# Altium schematic sheet CNEPuckRevG_Drivers_1.SchDoc: Cable Node Expansion Puck
size C; Author: JDV; CompanyName: OPIsystems Inc; DrawnBy: JDV; Engineer: JDV; Organization: OPIsystems Inc; DocumentNumber: CNE; Revision: REV G; SheetNumber: 2; SheetTotal: 3; ProjectName: Swage
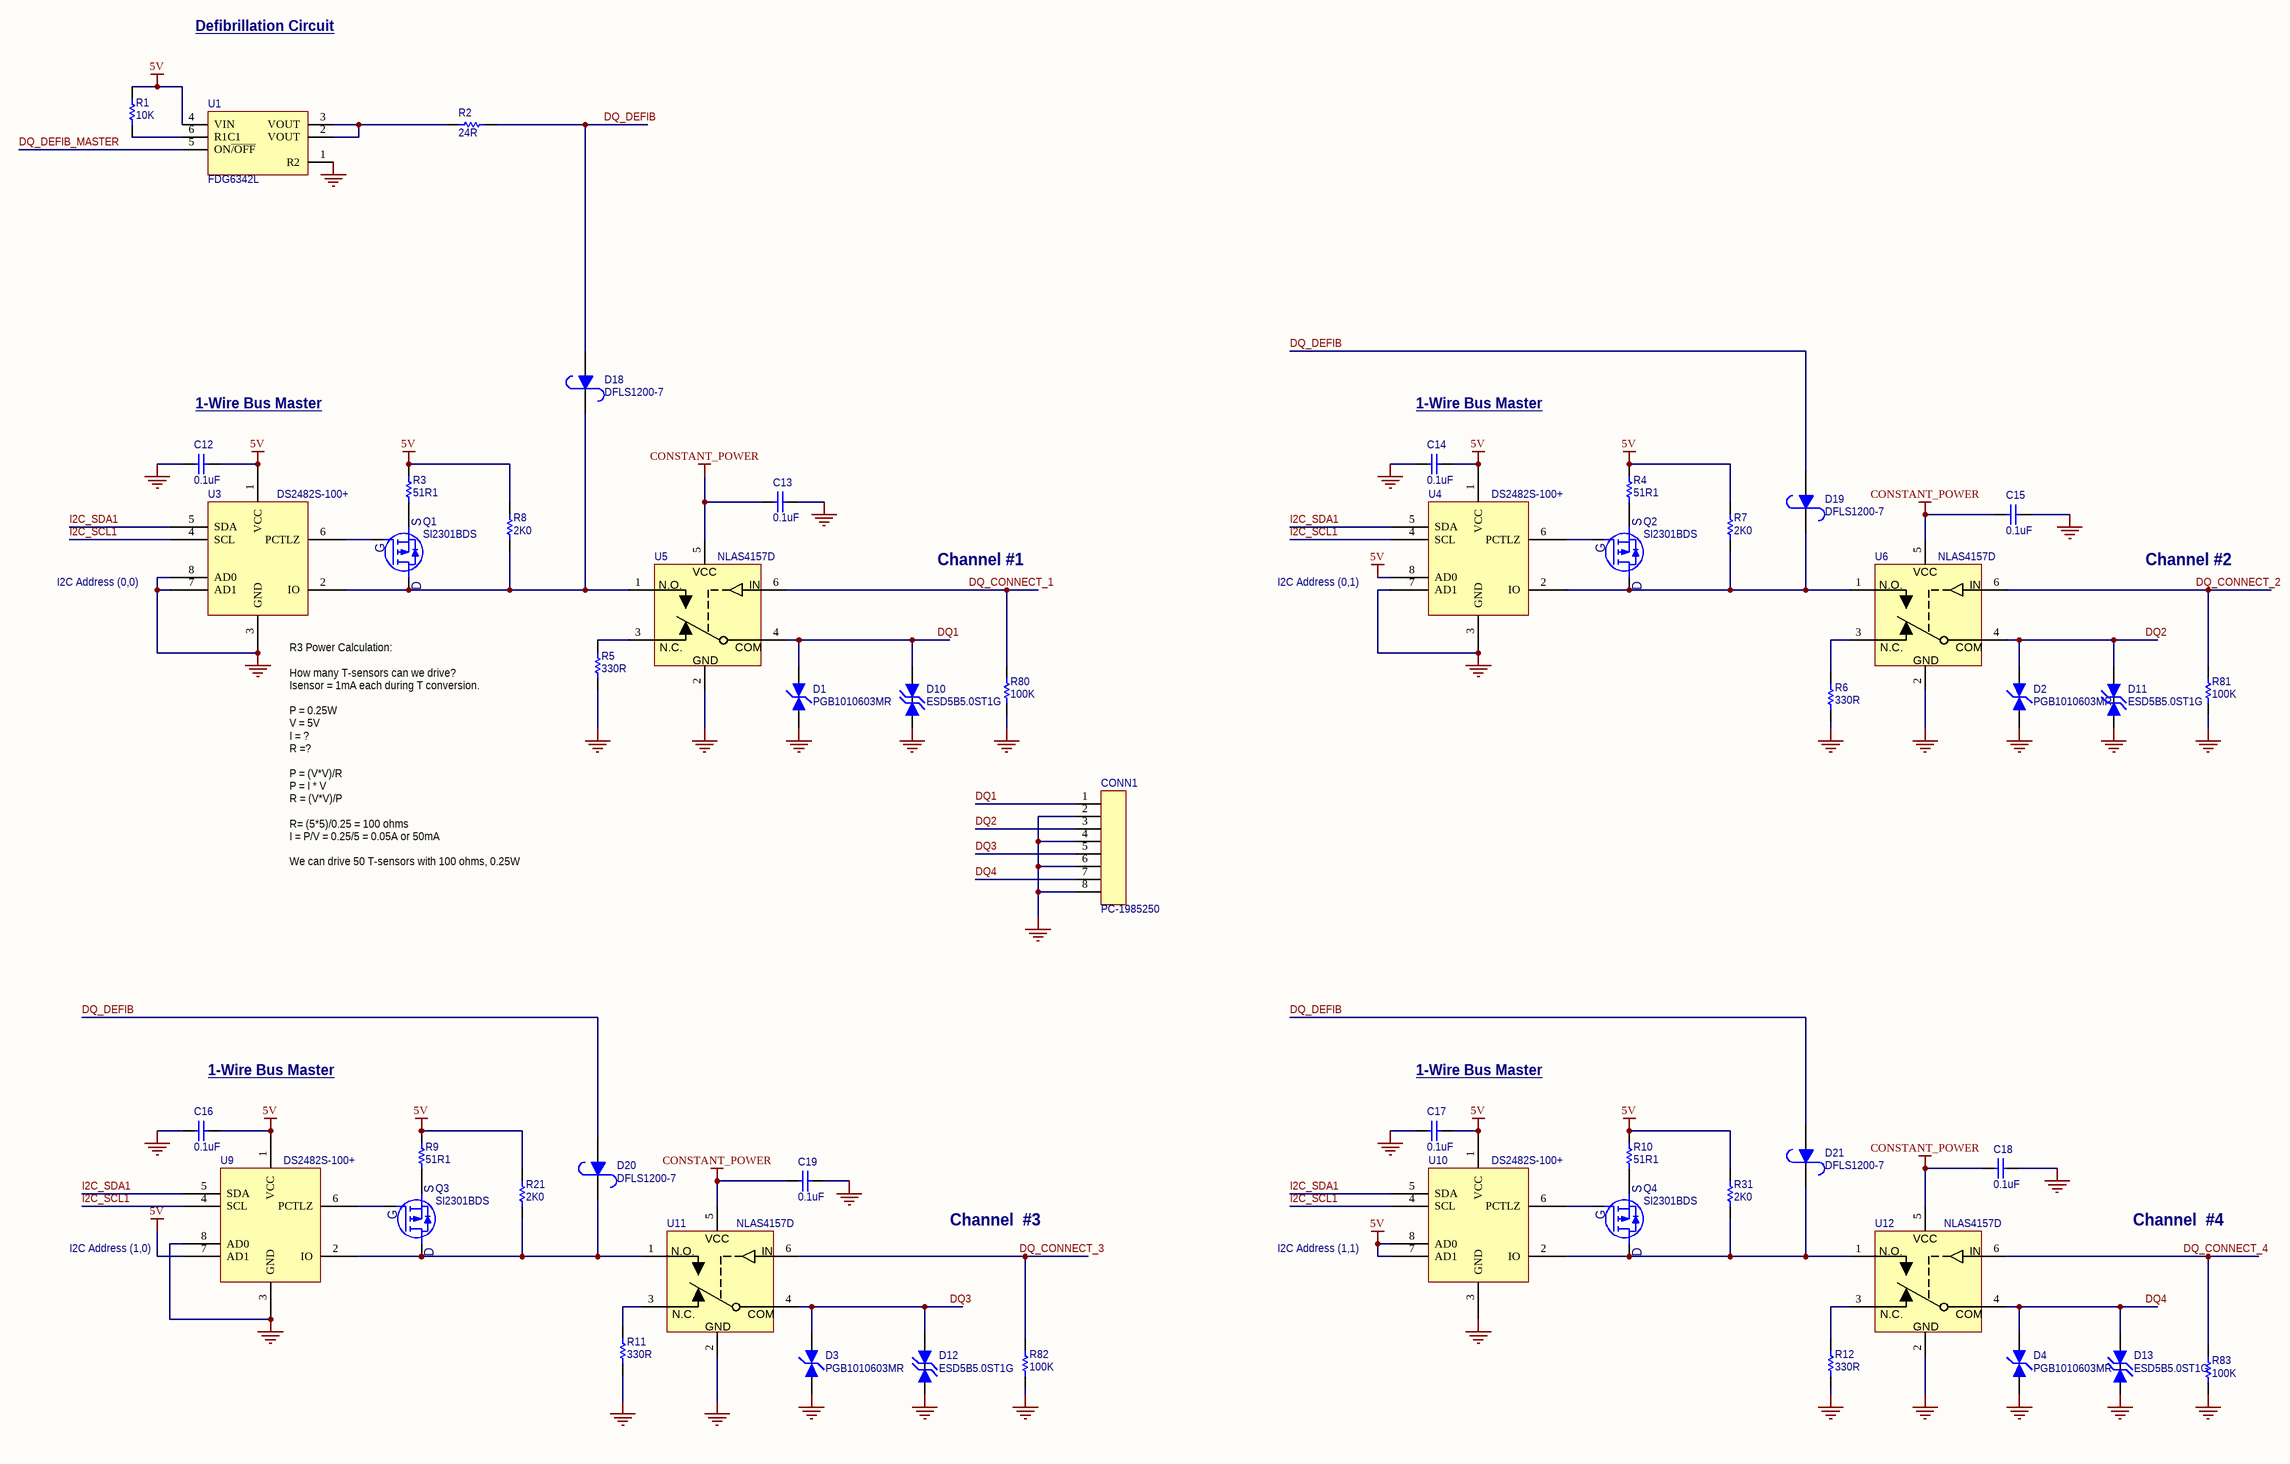
[diagram p0: CNEPuckRevG_Drivers_1.SchDoc]

## Parts
C12  0.1uF  [RC0603]
C13  0.1uF  [RC0603]
C14  0.1uF  [RC0603]
C15  0.1uF  [RC0603]
C16  0.1uF  [RC0603]
C17  0.1uF  [RC0603]
C18  0.1uF  [RC0603]
C19  0.1uF  [RC0603]
CONN1  PC-1985250  [PTSA1.5/8-3.5-Z]
D1  PGB1010603MR  [RC0603]
D2  PGB1010603MR  [RC0603]
D3  PGB1010603MR  [RC0603]
D4  PGB1010603MR  [RC0603]
D10  ESD5B5.0ST1G  [SOD-523]
D11  ESD5B5.0ST1G  [SOD-523]
D12  ESD5B5.0ST1G  [SOD-523]
D13  ESD5B5.0ST1G  [SOD-523]
D18  DFLS1200-7  [POWERDI-123]
D19  DFLS1200-7  [POWERDI-123]
D20  DFLS1200-7  [POWERDI-123]
D21  DFLS1200-7  [POWERDI-123]
Q1  SI2301BDS  [SOT23(DGS)]
Q2  SI2301BDS  [SOT23(DGS)]
Q3  SI2301BDS  [SOT23(DGS)]
Q4  SI2301BDS  [SOT23(DGS)]
R1  10K  [RC0603]
R2  24R  [RES2512]
R3  51R1  [RC0603]
R4  51R1  [RC0603]
R5  330R  [RC0805]
R6  330R  [RC0805]
R7  2K0  [RC0603]
R8  2K0  [RC0603]
R9  51R1  [RC0603]
R10  51R1  [RC0603]
R11  330R  [RC0805]
R12  330R  [RC0805]
R21  2K0  [RC0603]
R31  2K0  [RC0603]
R80  100K  [RC0603]
R81  100K  [RC0603]
R82  100K  [RC0603]
R83  100K  [RC0603]
U1  FDG6342L  [TS5A3160]
U3  DS2482S-100+  [SOIC127P580X153-8N]
U4  DS2482S-100+  [SOIC127P580X153-8N]
U5  NLAS4157D  [TS5A3160]
U6  NLAS4157D  [TS5A3160]
U9  DS2482S-100+  [SOIC127P580X153-8N]
U10  DS2482S-100+  [SOIC127P580X153-8N]
U11  NLAS4157D  [TS5A3160]
U12  NLAS4157D  [TS5A3160]

## Nets
5V: C12.2 C14.2 C16.2 C17.2 R1.1 R3.1 R4.1 R7.1 R8.1 R9.1 R10.1 R21.1 R31.1 U1.4(VIN) U3.1(VCC) U4.1(VCC) U4.8(AD0) U9.1(VCC) U9.7(AD1) U10.1(VCC) U10.7(AD1) U10.8(AD0)
CONSTANT_POWER: C13.1 C15.1 C18.1 C19.1 U5.5 U6.5 U11.5 U12.5
GND: C12.1 C13.2 C14.1 C15.2 C16.1 C17.1 C18.2 C19.2 CONN1.2 CONN1.4 CONN1.6 CONN1.8 D1.1 D2.1 D3.1 D4.1 D10.1 D11.1 D12.1 D13.1 R5.2 R6.2 R11.2 R12.2 R80.2 R81.2 R82.2 R83.2 U1.1(R2) U3.3(GND) U3.7(AD1) U3.8(AD0) U4.3(GND) U4.7(AD1) U5.2(GND) U6.2(GND) U9.3(GND) U9.8(AD0) U10.3(GND) U11.2(GND) U12.2(GND)
DQ1: CONN1.1 D1.2 D10.2 U5.4
DQ2: CONN1.3 D2.2 D11.2 U6.4
DQ3: CONN1.5 D3.2 D12.2 U11.4
DQ4: CONN1.7 D4.2 D13.2 U12.4
DQ_CONNECT_1: R80.1 U5.6
DQ_CONNECT_2: R81.1 U6.6
DQ_CONNECT_3: R82.1 U11.6
DQ_CONNECT_4: R83.1 U12.6
DQ_DEFIB: D18.1(A) D19.1(A) D20.1(A) D21.1(A) R2.2
DQ_DEFIB_MASTER: U1.5(ON~{/OFF})
I2C_SCL1: U3.4(SCL) U4.4(SCL) U9.4(SCL) U10.4(SCL)
I2C_SDA1: U3.5(SDA) U4.5(SDA) U9.5(SDA) U10.5(SDA)
NetD18_2: D18.2(K) Q1.D R8.2 U3.2(IO) U5.1(NO)
NetD19_2: D19.2(K) Q2.D R7.2 U4.2(IO) U6.1(NO)
NetD20_2: D20.2(K) Q3.D R21.2 U9.2(IO) U11.1(NO)
NetD21_2: D21.2(K) Q4.D R31.2 U10.2(IO) U12.1(NO)
NetQ1_G: Q1.G U3.6(PCTLZ)
NetQ1_S: Q1.S R3.2
NetQ2_G: Q2.G U4.6(PCTLZ)
NetQ2_S: Q2.S R4.2
NetQ3_G: Q3.G U9.6(PCTLZ)
NetQ3_S: Q3.S R9.2
NetQ4_G: Q4.G U10.6(PCTLZ)
NetQ4_S: Q4.S R10.2
NetR1_2: R1.2 U1.6(R1C1)
NetR2_1: R2.1 U1.2(VOUT) U1.3(VOUT)
NetR5_1: R5.1 U5.3(NC)
NetR6_1: R6.1 U6.3(NC)
NetR11_1: R11.1 U11.3(NC)
NetR12_1: R12.1 U12.3(NC)

## Notes on the sheet
- Defibrillation Circuit
- 1-Wire Bus Master
- I2C Address (0,0)
- Channel #1
- I2C Address (0,1)
- Channel #2
- (near U3) R3 Power Calculation:
  How many T-sensors can we drive?
  Isensor = 1mA each during T conversion.
  P = 0.25W
  V = 5V
  I = ?
  R =?
  P = (V*V)/R
  P = I * V
  R = (V*V)/P
  R= (5*5)/0.25 = 100 ohms
  I = P/V = 0.25/5 = 0.05A or 50mA
  We can drive 50 T-sensors with 100 ohms, 0.25W resistor.
- Channel  #3
- Channel  #4
- I2C Address (1,0)
- I2C Address (1,1)
- Title:
- OPIsystems Inc.
- Size:
- Date:
- File:
- C
- Number:
- Time:
- Revision:
- Sheet
- of
- Calgary, AB, Canada
- T2E 6M8
- 403-219-3177
- www.opisystems.com
- 1216 - 36th Avenue NE
- (in symbol NLAS4157DFT2G) VCC; N.O.; IN; N.C.; COM

## Library data of the parts
C12-C19 = 0603YC104KAT2A: CAP CERM .1UF 10% 16V X7R 0603; Manufacturer: AVX Corporation; Category 1: Capacitors; Capacitance: 0.1µF; OPI_VID: 100039; Supplier 1: Digi-Key; Supplier Part Number 1: 478-1239-2-ND; RoHS 1: RoHS Compliant; Description 1: CAP CERM .1UF 10% 16V X7R 0603; Stock 1: 5240000; Pricing 1: 4000=0.003, 12000=0.002, 24000=0.002 (USD); Voltage - Rated: 16V; Tolerance: ±10%; Temperature Coefficient: X7R; Mounting Type: Surface Mount, MLCC; Operating Temperature: -55°C ~ 125°C; Features: -; Applications: General Purpose; Ratings: -; Package / Case: 0603 (1608 Metric); Size / Dimension: 0.063" L x 0.031" W (1.60mm x 0.80mm); Thickness: 0.90mm Max; Lead Spacing: -; Packaging: Tape & Reel (TR); Lead Style: -; ComponentLink1URL: http://www.avx.com/docs/Catalogs/cx7r.pdf; ComponentLink1Description: http://www.avx.com/docs/Catalogs/cx7r.pdf; Manufacturer Part Number: 0603YC104KAT2A
CONN1 = 1985250: TERM BLOCK PCB 8POS 3.5MM GREEN; Manufacturer: Phoenix Contact; Number of Levels: 1; Positions Per Level: 8; Pitch: 0.138" (3.50mm); Mating Orientation: 45° (135°) Angle with Board; Current: 2A; Voltage: 300V; Wire Gauge: 16-24 AWG; Wire Termination: Screwless - Spring Cage, Tension Clamp; OPI_VID: 101356; Supplier 1: Digi-Key; Manufacturer Part Number: 1985250; RoHS: RoHS Compliant; Category: Connectors, Interconnects; Stock 1: 3617; Pricing 1: 1=0.9, 10=0.861, 50=0.8374, 100=0.7828, 250=0.72016, 500=0.66536 (CAD); Mounting Type: Through Hole; Features: -; Color: Green; Packaging: Bulk; Operating Temperature: -; Housing Material: Polyamide (PA), Nylon; Contact Material - Plating: -; Clamp Material - Plating: -; Screw Material - Plating: -; Torque - Screw: -; Screw Thread: -; ComponentLink1URL: http://www.phoenixcontact.com/online/portal/us/pxc/product_detail_page/!ut/p/b1/04_SjzQ0tTQ2MTMzM7TQj9CPykssy0xPLMnMz0vMAfGjzOJDnEJcXQOMzAz9A02dDDxdTJ1dfUyCDD38jIAKIvEocDQkTr8BDuBoQEh_uH4UXiUgF4AV4LHCzyM_N1U_NyrHzdJT1xEAasn7vg!!/dl4/d5/L0lDU0lKSmdrS0NsRUp; ComponentLink1Description: http://www.phoenixcontact.com/online/portal/us/pxc/product_detail_page/!ut/p/b1/04_SjzQ0tTQ2MTMzM7TQj9CPykssy0xPLMnMz0vMAfGjzOJDnEJcXQOMzAz9A02dDDxdTJ1dfUyCDD38jIAKIvEocDQkTr8BDuBoQEh_uH4UXiUgF4AV4LHCzyM_N1U_NyrHzdJT1xEAasn7vg!!/dl4/d5/L0lDU0lKSmdrS0NsRUp; Supplier Part Number 1: 277-1628-ND
D1-D4 = PGB1010603MR: SUPPRESSOR ESD 24VDC 0603 SMD; Manufacturer: Littelfuse Inc; Category 1: Circuit Protection; Voltage - Reverse Standoff (Typ): 24V; Polarization: Bidirectional; OPI_VID: 101020; Supplier 1: Digi-Key; Supplier Part Number 1: F3591TR-ND; RoHS 1: RoHS Compliant; Description 1: SUPPRESSOR ESD 24VDC 0603 SMD; Stock 1: 10000; Pricing 1: 5000=0.189, 10000=0.176, 25000=0.166 (USD); Voltage - Breakdown: -; Mounting Type: Surface Mount; Package / Case: 0603 (1608 Metric); Supplier Device Package: 0603 (1608 Metric); Packaging: Tape & Reel (TR); ComponentLink1URL: http://www.littelfuse.com/data/en/Data_Sheets/Littelfuse_PulseGuard-ESD_PGB1.pdf; ComponentLink1Description: http://www.littelfuse.com/data/en/Data_Sheets/Littelfuse_PulseGuard-ESD_PGB1.pdf; Manufacturer Part Number: PGB1010603MR
D10-D13 = ESD5B5.0ST1G: TVS BIDIRECT 50W SOD523; Manufacturer: ON Semiconductor; Voltage - Reverse Standoff (Typ): 5V; Voltage - Breakdown: 5.8V; Polarization: Bidirectional; OPI_VID: 101019; Supplier 1: Digi-Key; Supplier Part Number 1: ESD5B5.0ST1GOSTR-ND; Manufacturer Part Number: ESD5B5.0ST1G; RoHS: RoHS Compliant; Category: Circuit Protection; Stock 1: 240000; Pricing 1: 3000=0.06935, 6000=0.06253, 12000=0.05571, 24000=0.0523, 48000=0.04661, 96000=0.04548 (CAD); Power (Watts): 50W; Mounting Type: Surface Mount; Package / Case: SC-79, SOD-523; Supplier Device Package: SOD-523; Packaging: Tape & Reel (TR); ComponentLink1URL: http://www.onsemi.com/pub_link/Collateral/ESD5B5.0ST1G.PDF; ComponentLink1Description: http://www.onsemi.com/pub_link/Collateral/ESD5B5.0ST1G.PDF
D18-D21 = DFLS1200-7: DIODE SCHOTTKY 1A 200V PWRDI 123; Manufacturer: Diodes Inc; Voltage - Forward (Vf) (Max) @ If: 850mV @ 1A; Speed: Fast Recovery =< 500ns, > 200mA (Io); Current - Reverse Leakage @ Vr: 2µA @ 200V; Capacitance @ Vr, F: 23pF @ 5V, 1MHz; OPI_VID: 101018; Supplier 1: Digi-Key; Supplier Part Number 1: DFLS1200DITR-ND; Manufacturer Part Number: DFLS1200-7; RoHS: RoHS Compliant; Category: Discrete Semiconductor Products; Stock 1: 21000; Pricing 1: 3000=0.22411, 6000=0.21017, 12000=0.19516, 27000=0.18444, 51000=0.18122 (CAD); Diode Type: Schottky; Voltage - DC Reverse (Vr) (Max): 200V; Current - Average Rectified (Io): 1A; Reverse Recovery Time (trr): -; Mounting Type: Surface Mount; Package / Case: 2-SMD, Flat Lead; Supplier Device Package: PowerDI™ 123; Packaging: Tape & Reel (TR); ComponentLink1URL: http://www.diodes.com/datasheets/ds30628.pdf; ComponentLink1Description: http://www.diodes.com/datasheets/ds30628.pdf
Q1-Q4 = SI2301BDS-T1-E3: MOSFET P-CH 20V 2.2A SOT23-3; Manufacturer: Vishay/Siliconix; FET Type: MOSFET P-Channel, Metal Oxide; FET Feature: Logic Level Gate; Rds On (Max) @ Id, Vgs: 100 mOhm @ 2.8A, 4.5V; Vgs(th) (Max) @ Id: 950mV @ 250µA; Gate Charge (Qg) @ Vgs: 10nC @ 4.5V; Input Capacitance (Ciss) @ Vds: 375pF @ 6V; Power - Max: 700mW; OPI_VID: 100638; Supplier 1: Digi-Key; Supplier Part Number 1: SI2301BDS-T1-E3TR-ND; Manufacturer Part Number: SI2301BDS-T1-E3; RoHS: RoHS Compliant; Category: Discrete Semiconductor Products; Stock 1: 27000; Pricing 1: 3000=0.18924, 6000=0.17754, 12000=0.16479, 27000=0.15628, 51000=0.15309 (CAD); Drain to Source Voltage (Vdss): 20V; Current - Continuous Drain (Id) @ 25° C: 2.2A; Mounting Type: Surface Mount; Package / Case: TO-236-3, SC-59, SOT-23-3; Supplier Device Package: SOT-23-3 (TO-236); Packaging: Tape & Reel (TR); ComponentLink1URL: http://www.vishay.com/doc?72066; ComponentLink1Description: http://www.vishay.com/doc?72066
R1 = ERJ-3GEYJ103V: RES 10K OHM 1/10W 5% 0603 SMD; Manufacturer: Panasonic Electronic Components; Power (Watts): 0.1W, 1/10W; Temperature Coefficient: ±200ppm/°C; OPI_VID: 101044; Supplier 1: Digi-Key; Manufacturer Part Number: ERJ-3GEYJ103V; RoHS: RoHS Compliant; Category: Resistors; Stock 1: 13440000; Pricing 1: 5000=0.00174, 10000=0.00151, 25000=0.00132, 50000=0.00122, 125000=0.00119 (CAD); Resistance (Ohms): 10k; Composition: Thick Film; Features: -; Tolerance: ±5%; Package / Case: 0603 (1608 Metric); Size / Dimension: 0.063" L x 0.031" W (1.60mm x 0.80mm); Height: 0.022" (0.55mm); Number of Terminations: 2; Packaging: Tape & Reel (TR); ComponentLink1URL: http://industrial.panasonic.com/www-cgi/jvcr13pz.cgi?E+PZ+3+AOA0001+ERJ3GEYJ103V+7+WW; ComponentLink1Description: http://industrial.panasonic.com/www-cgi/jvcr13pz.cgi?E+PZ+3+AOA0001+ERJ3GEYJ103V+7+WW; Supplier Part Number 1: P10KGTR-ND
R2 = RMCF2512JT24R0: RES 24 OHM 1W 5% 2512 SMD; Manufacturer: Vishay/Dale; Manufacturer Part Number: CRCW251224R0JNEG; Resistance (Ohms): 24; Temperature Coefficient: ±200ppm/°C; OPI_VID: 101380; Supplier 1: Digi-Key; Supplier Part Number 1: RMCF2512JT24R0TR-ND; RoHS: RoHS Compliant; Category: Resistors; Stock 1: 20000; Pricing 1: 4000=0.03773, 8000=0.0343, 12000=0.03201, 28000=0.03041, 100000=0.02916 (CAD); Power (Watts): 1W; Composition: Thick Film; Features: -; Tolerance: ±5%; Package / Case: 2512 (6432 Metric); Supplier Device Package: 2512; Size / Dimension: 0.248" L x 0.126" W (6.30mm x 3.20mm); Height: 0.028" (0.70mm); Number of Terminations: 2; Packaging: Tape & Reel (TR); ComponentLink1URL: http://www.seielect.com/Catalog/SEI-RMCF_RMCP.pdf; ComponentLink1Description: http://www.seielect.com/Catalog/SEI-RMCF_RMCP.pdf
R3 R4 R9 R10 = CRCW060351R1FKEAHP: RES 51.1 OHM .25W 1% 0603 SMD; Manufacturer: Vishay Dale; Resistance (Ohms): 51.1; Power (Watts): 0.25W, 1/4W; Temperature Coefficient: ±100ppm/°C; OPI_VID: 101449; Supplier 1: Digi-Key; Manufacturer Part Number: CRCW060351R1FKEAHP; RoHS: RoHS Compliant; Category: Resistors; Stock 1: 5000; Pricing 1: 5000=0.0351, 10000=0.03159, 25000=0.02808, 50000=0.0234, 100000=0.01942, 250000=0.01755, 500000=0.0158 (USD); Composition: Thick Film; Features: Automotive AEC-Q200 Qualified, Pulse Withstanding; Tolerance: ±1%; Package / Case: 0603 (1608 Metric); Supplier Device Package: 0603 (1608 Metric); Size / Dimension: 0.063" L x 0.033" W (1.60mm x 0.85mm); Height: 0.022" (0.55mm); Number of Terminations: 2; Packaging: Tape & Reel (TR); ComponentLink1URL: http://www.vishay.com/docs/20043/crcwhpe3.pdf; ComponentLink1Description: http://www.vishay.com/docs/20043/crcwhpe3.pdf; Supplier Part Number 1: 541-51.1STR-ND
R5 R6 R11 R12 = ERJ-6GEYJ331V: RES 330 OHM 1/8W 5% 0805 SMD; Manufacturer: KOA Speer Technologies; Manufacturer Part Number: RK73B2ATTD331J; Resistance (Ohms): 330; Power (Watts): 0.125W, 1/8W; Temperature Coefficient: ±200ppm/°C; OPI_VID: 101386; Supplier 1: Digi-Key; RoHS: RoHS Compliant; Category: Resistors; Stock 1: 895000; Pricing 1: 5000=0.00304, 10000=0.00264, 25000=0.00232, 50000=0.00213, 125000=0.00208 (CAD); Composition: Thick Film; Features: -; Tolerance: ±5%; Package / Case: 0805 (2012 Metric); Size / Dimension: 0.079" L x 0.049" W (2.00mm x 1.25mm); Height: 0.028" (0.70mm); Number of Terminations: 2; Packaging: Tape & Reel (TR); ComponentLink1URL: http://industrial.panasonic.com/www-cgi/jvcr13pz.cgi?E+PZ+3+AOA0001+ERJ6GEYJ331V+7+WW; ComponentLink1Description: http://industrial.panasonic.com/www-cgi/jvcr13pz.cgi?E+PZ+3+AOA0001+ERJ6GEYJ331V+7+WW; Supplier Part Number 1: P330ATR-ND
R7 R8 R21 R31 = ERJ-3EKF2001V: RES 2K OHM 1/10W 1% 0603 SMD; Manufacturer: Panasonic Electronic Components; Power (Watts): 0.1W, 1/10W; Temperature Coefficient: ±100ppm/°C; OPI_VID: 101487; Supplier 1: Digi-Key; Supplier Part Number 1: P2.00KHTR-ND; Manufacturer Part Number: ERJ-3EKF2001V; RoHS: RoHS Compliant; Category: Resistors; Stock 1: 1000000; Pricing 1: 5000=0.00272, 10000=0.00236, 25000=0.00207, 50000=0.0019, 125000=0.00186 (CAD); Packaging: Tape & Reel (TR); Resistance (Ohms): 2k; Composition: Thick Film; Features: -; Tolerance: ±1%; Package / Case: 0603 (1608 Metric); Supplier Device Package: 0603; Size / Dimension: 0.063" L x 0.031" W (1.60mm x 0.80mm); Height: 0.022" (0.55mm); Number of Terminations: 2; ComponentLink1URL: http://industrial.panasonic.com/www-cgi/jvcr13pz.cgi?E+PZ+3+AOA0002+ERJ3EKF2001V+7+WW; ComponentLink1Description: http://industrial.panasonic.com/www-cgi/jvcr13pz.cgi?E+PZ+3+AOA0002+ERJ3EKF2001V+7+WW
R80-R83 = ERJ-3GEYJ104V: RES 100K OHM 1/10W 5% 0603 SMD; Manufacturer: Panasonic Electronic Components; Power (Watts): 0.1W, 1/10W; Temperature Coefficient: ±200ppm/°C; OPI_VID: 101335; Supplier 1: Digi-Key; Manufacturer Part Number: ERJ-3GEYJ104V; RoHS: RoHS Compliant; Category: Resistors; Stock 1: 3755000; Pricing 1: 5000=0.00172, 10000=0.00149, 25000=0.00131, 50000=0.0012, 125000=0.00118 (CAD); Resistance (Ohms): 100k; Composition: Thick Film; Features: -; Tolerance: ±5%; Package / Case: 0603 (1608 Metric); Size / Dimension: 0.063" L x 0.031" W (1.60mm x 0.80mm); Height: 0.022" (0.55mm); Number of Terminations: 2; Packaging: Tape & Reel (TR); ComponentLink1URL: http://industrial.panasonic.com/www-cgi/jvcr13pz.cgi?E+PZ+3+AOA0001+ERJ3GEYJ104V+7+WW; ComponentLink1Description: http://industrial.panasonic.com/www-cgi/jvcr13pz.cgi?E+PZ+3+AOA0001+ERJ3GEYJ104V+7+WW; Supplier Part Number 1: P100KGTR-ND
U1 = FDG6342L: IC LOAD SWITCH INTEGRATED SC70-6; Manufacturer: Fairchild Semiconductor; Number of Outputs: 1; Rds (On): 150 mOhm; Internal Switch(s): Yes; Current Limit: 1.5A; Voltage - Input: 2.5 V ~ 8 V; OPI_VID: 101348; Supplier 1: Digi-Key; Manufacturer Part Number: FDG6342L; RoHS: RoHS Compliant; Category: Integrated Circuits (ICs); Stock 1: 24000; Pricing 1: 3000=0.13942, 6000=0.13097, 15000=0.12252, 30000=0.11238, 75000=0.10816, 150000=0.10393 (CAD); Type: High Side Switch; Operating Temperature: -55°C ~ 150°C; Mounting Type: Surface Mount; Package / Case: 6-TSSOP, SC-88, SOT-363; Supplier Device Package: SC-70-6; Packaging: Tape & Reel (TR); ComponentLink1URL: http://www.fairchildsemi.com/ds/FD/FDG6342L.pdf; ComponentLink1Description: http://www.fairchildsemi.com/ds/FD/FDG6342L.pdf; Supplier Part Number 1: FDG6342LTR-ND
U3 U4 U9 U10 = DS2482S-100+: IC BRIDGE I2C TO 1-WIRE 8-SOIC; Manufacturer: Maxim Integrated; Controller Type: I²C Bus Controller; Interface: I²C; Voltage - Supply: 3.3V, 5V; Current - Supply: 750µA; OPI_VID: 101350; Supplier 1: Digi-Key; Manufacturer Part Number: DS2482S-100+; RoHS: RoHS Compliant; Category: Integrated Circuits (ICs); Stock 1: 830; Pricing 1: 1=1.79, 25=1.1904, 100=0.8686, 1000=0.77314 (CAD); Operating Temperature: -40°C ~ 85°C; Mounting Type: Surface Mount; Package / Case: 8-SOIC (0.154", 3.90mm Width); Supplier Device Package: 8-SOIC; Packaging: Tube; ComponentLink1URL: http://datasheets.maxim-ic.com/en/ds/DS2482-100.pdf; ComponentLink1Description: http://datasheets.maxim-ic.com/en/ds/DS2482-100.pdf; Supplier Part Number 1: DS2482S-100+-ND
U5 U6 U11 U12 = NLAS4157DFT2G: IC SWITCH SPDT SC88; Manufacturer: ON Semiconductor; Circuit: 1 x SPDT; On-State Resistance: 1.15 Ohm; Voltage Supply Source: Single Supply; Voltage - Supply, Single/Dual (±): 1.65 V ~ 5.5 V; Current - Supply: 500nA; OPI_VID: 101351; Supplier 1: Digi-Key; Manufacturer Part Number: NLAS4157DFT2G; RoHS: RoHS Compliant; Category: Integrated Circuits (ICs); Stock 1: 3000; Pricing 1: 3000=0.15291, 6000=0.14305, 15000=0.13318, 30000=0.12628, 75000=0.12332, 150000=0.11838 (CAD); Function: Switch; Operating Temperature: -40°C ~ 85°C; Mounting Type: Surface Mount; Package / Case: 6-TSSOP, SC-88, SOT-363; Supplier Device Package: SC-88; Packaging: Tape & Reel (TR); ComponentLink1URL: http://www.onsemi.com/pub_link/Collateral/NLAS4157-D.PDF; ComponentLink1Description: http://www.onsemi.com/pub_link/Collateral/NLAS4157-D.PDF; Supplier Part Number 1: NLAS4157DFT2GOSTR-ND